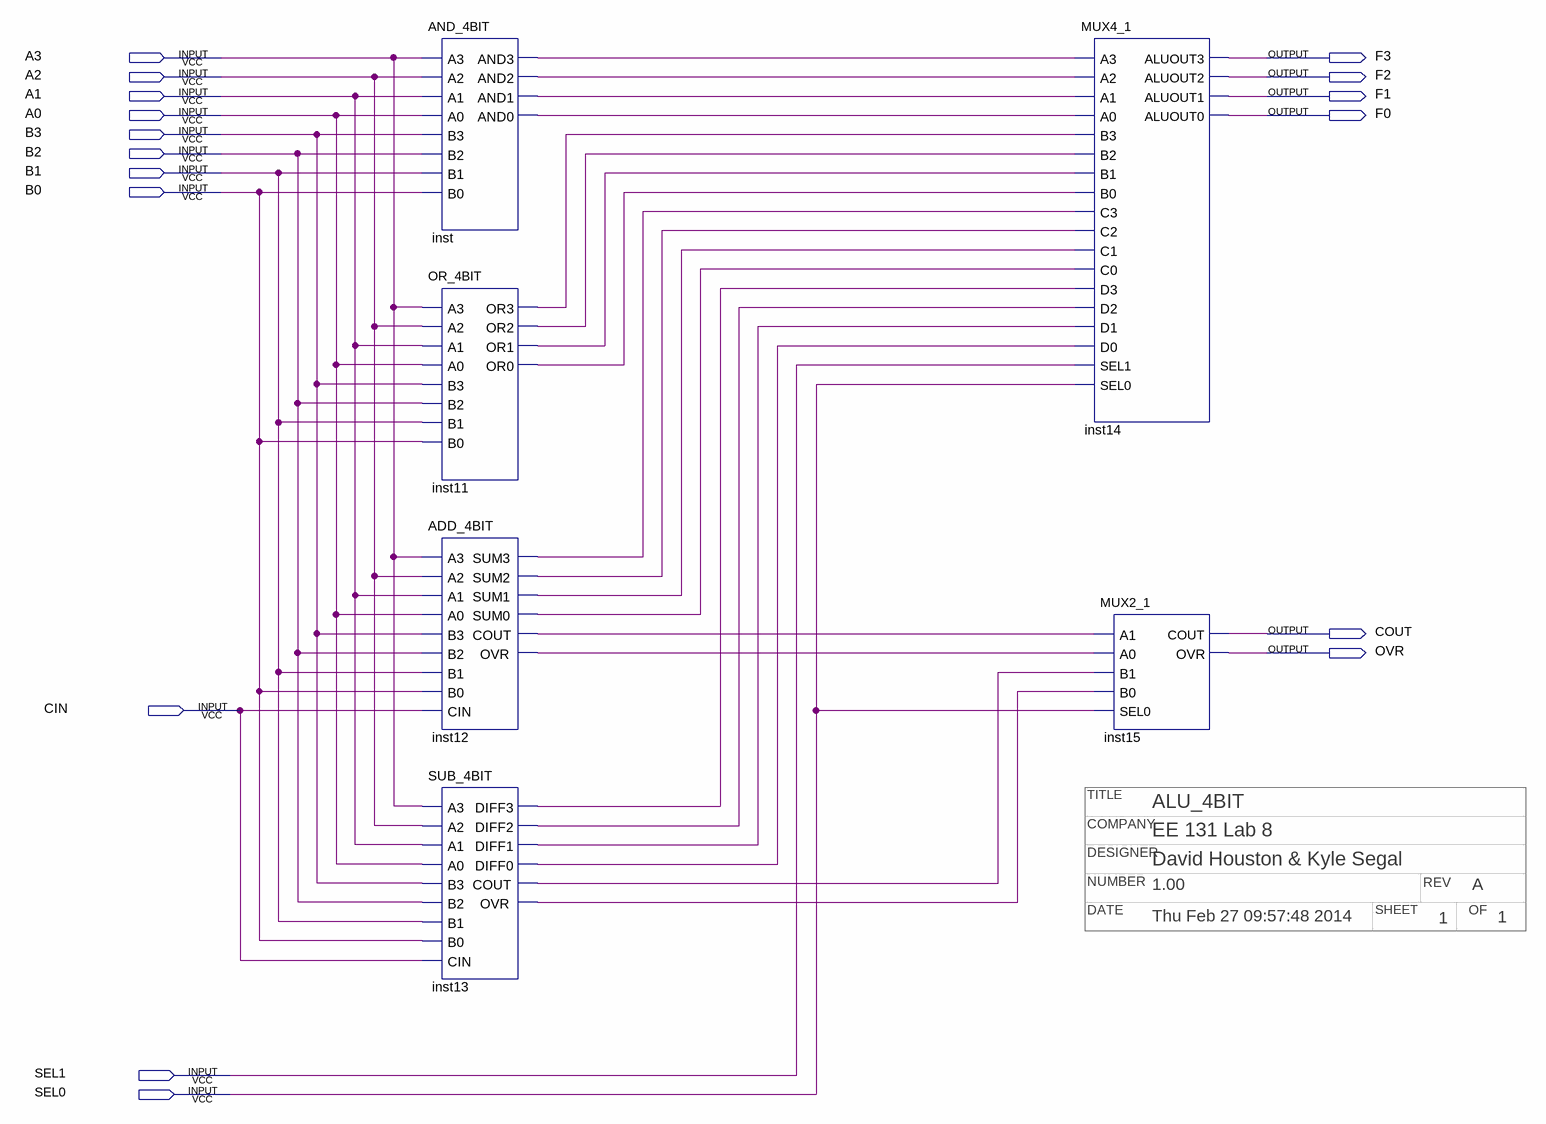
[diagram p0: schematic sheet]
// Quartus schematic ALU_4BIT.bdf as structural Verilog: 6 symbols, 17 pins
// Title block: TITLE: ALU_4BIT; COMPANY: EE 131 Lab 8; DESIGNER: David Houston & Kyle Segal; NUMBER: 1.00; REV: A; DATE: Thu Feb 27 09:57:48 2014; SHEET: 1; OF: 1
module ALU_4BIT (
  input  A3,
  input  A2,
  input  A1,
  input  A0,
  input  B3,
  input  B2,
  input  B1,
  input  B0,
  input  CIN,
  input  SEL1,
  input  SEL0,
  output F3,
  output F2,
  output F1,
  output F0,
  output COUT,
  output OVR
);

  wire inst11_or0, inst11_or1, inst11_or2, inst11_or3, inst12_cout, inst12_ovr, inst12_sum0, inst12_sum1,
       inst12_sum2, inst12_sum3, inst13_cout, inst13_diff0, inst13_diff1, inst13_diff2, inst13_diff3,
       inst13_ovr, inst_and0, inst_and1, inst_and2, inst_and3;

  AND_4BIT inst (
    .A3(A3), .A2(A2), .A1(A1), .A0(A0), .B3(B3), .B2(B2), .B1(B1), .B0(B0), .AND3(inst_and3),
    .AND2(inst_and2), .AND1(inst_and1), .AND0(inst_and0));
  OR_4BIT inst11 (
    .A3(A3), .A2(A2), .A1(A1), .A0(A0), .B3(B3), .B2(B2), .B1(B1), .B0(B0), .OR3(inst11_or3),
    .OR2(inst11_or2), .OR1(inst11_or1), .OR0(inst11_or0));
  ADD_4BIT inst12 (
    .A3(A3), .A2(A2), .A1(A1), .A0(A0), .B3(B3), .B2(B2), .B1(B1), .B0(B0), .CIN(CIN), .SUM3(inst12_sum3),
    .SUM2(inst12_sum2), .SUM1(inst12_sum1), .SUM0(inst12_sum0), .COUT(inst12_cout), .OVR(inst12_ovr));
  SUB_4BIT inst13 (
    .A3(A3), .A2(A2), .A1(A1), .A0(A0), .B3(B3), .B2(B2), .B1(B1), .B0(B0), .CIN(CIN), .DIFF3(inst13_diff3),
    .DIFF2(inst13_diff2), .DIFF1(inst13_diff1), .DIFF0(inst13_diff0), .COUT(inst13_cout), .OVR(inst13_ovr));
  MUX4_1 inst14 (
    .A3(inst_and3), .A2(inst_and2), .A1(inst_and1), .A0(inst_and0), .B3(inst11_or3), .B2(inst11_or2),
    .B1(inst11_or1), .B0(inst11_or0), .C3(inst12_sum3), .C2(inst12_sum2), .C1(inst12_sum1), .C0(inst12_sum0),
    .D3(inst13_diff3), .D2(inst13_diff2), .D1(inst13_diff1), .D0(inst13_diff0), .SEL1(SEL1), .SEL0(SEL0),
    .ALUOUT3(F3), .ALUOUT2(F2), .ALUOUT1(F1), .ALUOUT0(F0));
  MUX2_1 inst15 (
    .A1(inst12_cout), .A0(inst12_ovr), .B1(inst13_cout), .B0(inst13_ovr), .SEL0(SEL0), .COUT(COUT), .OVR(OVR));
endmodule
